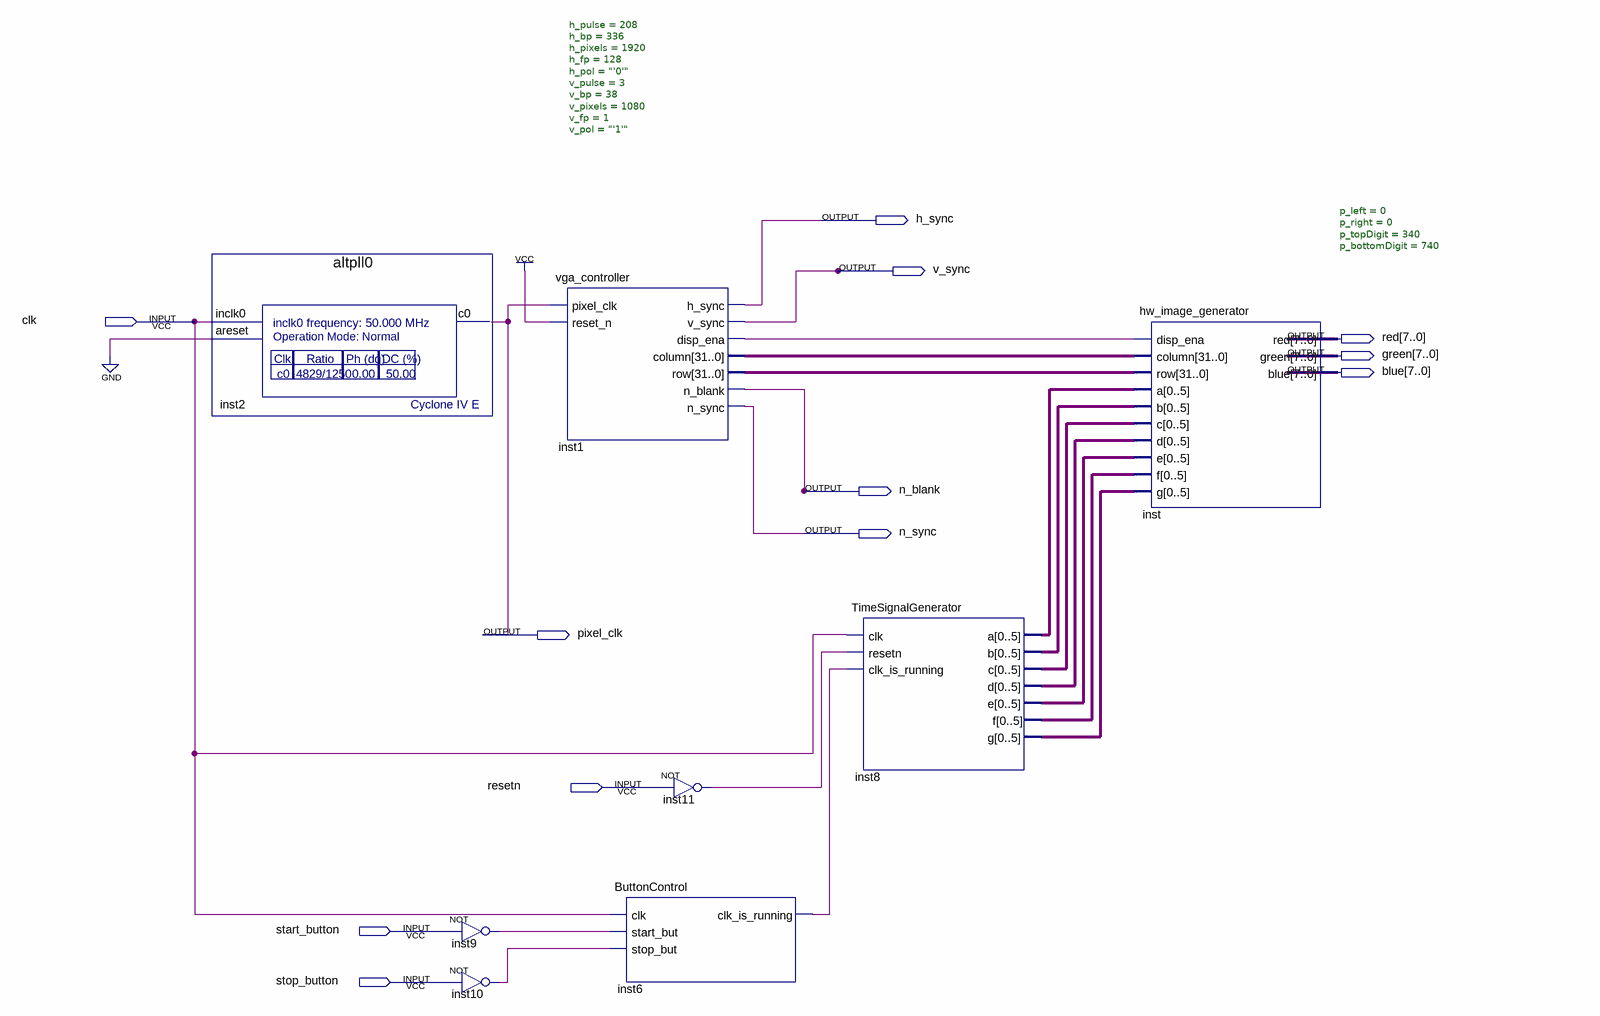
[diagram p0: schematic sheet]
// Quartus schematic vga_with_hw_test_image.bdf as structural Verilog: 8 symbols, 12 pins
module vga_with_hw_test_image (
  input  clk,
  input  resetn,
  input  start_button,
  input  stop_button,
  output h_sync,
  output v_sync,
  output [7:0] red,
  output [7:0] green,
  output [7:0] blue,
  output n_blank,
  output n_sync,
  output pixel_clk
);

  wire inst1_disp_ena, inst6_clk_is_running, inst9_out, inst10_out, inst11_out;
  wire [5:0] inst8_a, inst8_b, inst8_c, inst8_d, inst8_e, inst8_f, inst8_g;
  wire [31:0] inst1_column, inst1_row;

  altpll0 inst2 (.inclk0(clk), .areset(1'b0), .c0(pixel_clk));
  not inst9 (inst9_out, start_button);
  not inst10 (inst10_out, stop_button);
  vga_controller #(.h_pulse(208), .h_bp(336), .h_pixels(1920), .h_fp(128), .h_pol("'0'"), .v_pulse(3), .v_bp(38), .v_pixels(1080), .v_fp(1), .v_pol("'1'")) inst1 (
    .pixel_clk(pixel_clk), .reset_n(1'b1), .h_sync(h_sync), .v_sync(v_sync), .disp_ena(inst1_disp_ena),
    .column(inst1_column), .row(inst1_row), .n_blank(n_blank), .n_sync(n_sync));
  not inst11 (inst11_out, resetn);
  ButtonControl inst6 (.clk(clk), .start_but(inst9_out), .stop_but(inst10_out), .clk_is_running(inst6_clk_is_running));
  TimeSignalGenerator inst8 (
    .clk(clk), .resetn(inst11_out), .clk_is_running(inst6_clk_is_running), .a(inst8_a), .b(inst8_b),
    .c(inst8_c), .d(inst8_d), .e(inst8_e), .f(inst8_f), .g(inst8_g));
  hw_image_generator #(.p_left(0), .p_right(0), .p_topDigit(340), .p_bottomDigit(740)) inst (
    .disp_ena(inst1_disp_ena), .column(inst1_column), .row(inst1_row), .a(inst8_a), .b(inst8_b), .c(inst8_c),
    .d(inst8_d), .e(inst8_e), .f(inst8_f), .g(inst8_g), .red(red), .green(green), .blue(blue));
endmodule
